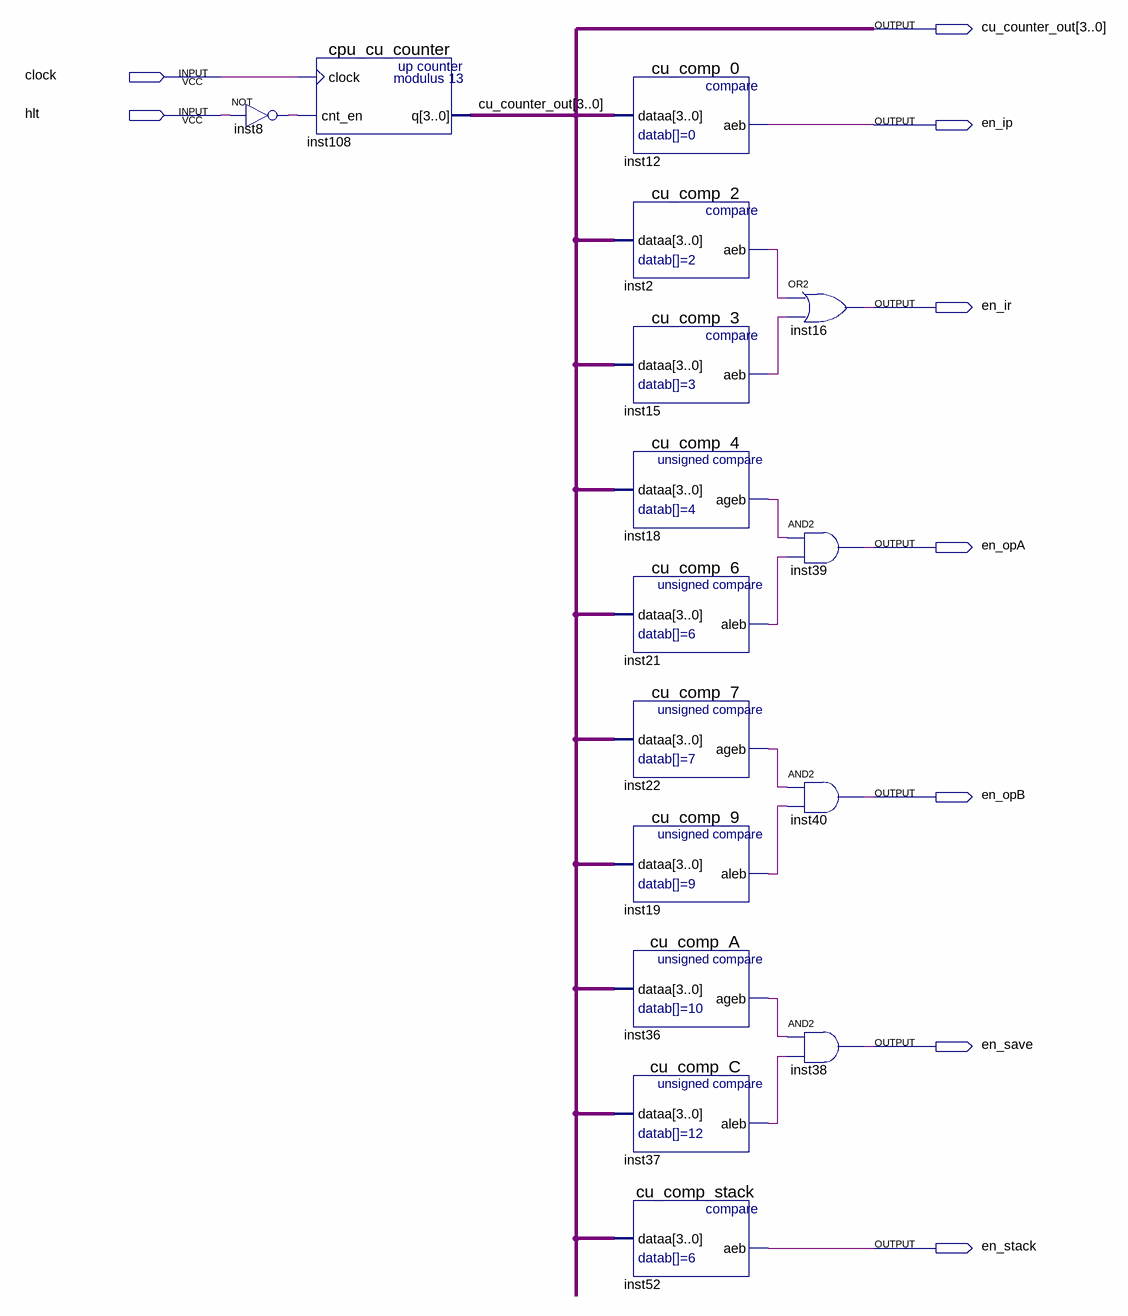
[diagram p0: schematic sheet]
// Quartus schematic CU.bdf as structural Verilog: 16 symbols, 9 pins
module CU (
  input  clock,
  input  hlt,
  output [3:0] cu_counter_out,
  output en_ip,
  output en_ir,
  output en_opA,
  output en_opB,
  output en_save,
  output en_stack
);

  wire inst2_aeb, inst8_out, inst15_aeb, inst18_ageb, inst19_aleb, inst21_aleb, inst22_ageb, inst36_ageb,
       inst37_aleb;

  not inst8 (inst8_out, hlt);
  cpu_cu_counter inst108 (.clock(clock), .cnt_en(inst8_out), .q(cu_counter_out));
  cu_comp_0 inst12 (.dataa(cu_counter_out), .aeb(en_ip));
  cu_comp_2 inst2 (.dataa(cu_counter_out), .aeb(inst2_aeb));
  cu_comp_3 inst15 (.dataa(cu_counter_out), .aeb(inst15_aeb));
  cu_comp_4 inst18 (.dataa(cu_counter_out), .ageb(inst18_ageb));
  cu_comp_6 inst21 (.dataa(cu_counter_out), .aleb(inst21_aleb));
  cu_comp_7 inst22 (.dataa(cu_counter_out), .ageb(inst22_ageb));
  cu_comp_9 inst19 (.dataa(cu_counter_out), .aleb(inst19_aleb));
  cu_comp_A inst36 (.dataa(cu_counter_out), .ageb(inst36_ageb));
  cu_comp_C inst37 (.dataa(cu_counter_out), .aleb(inst37_aleb));
  cu_comp_stack inst52 (.dataa(cu_counter_out), .aeb(en_stack));
  or inst16 (en_ir, inst2_aeb, inst15_aeb);
  and inst39 (en_opA, inst18_ageb, inst21_aleb);
  and inst40 (en_opB, inst22_ageb, inst19_aleb);
  and inst38 (en_save, inst36_ageb, inst37_aleb);
endmodule
